# Altium schematic sheet [00] - TK2560_MainBlock.SchDoc
size A3; SheetNumber: 3; SheetTotal: 15
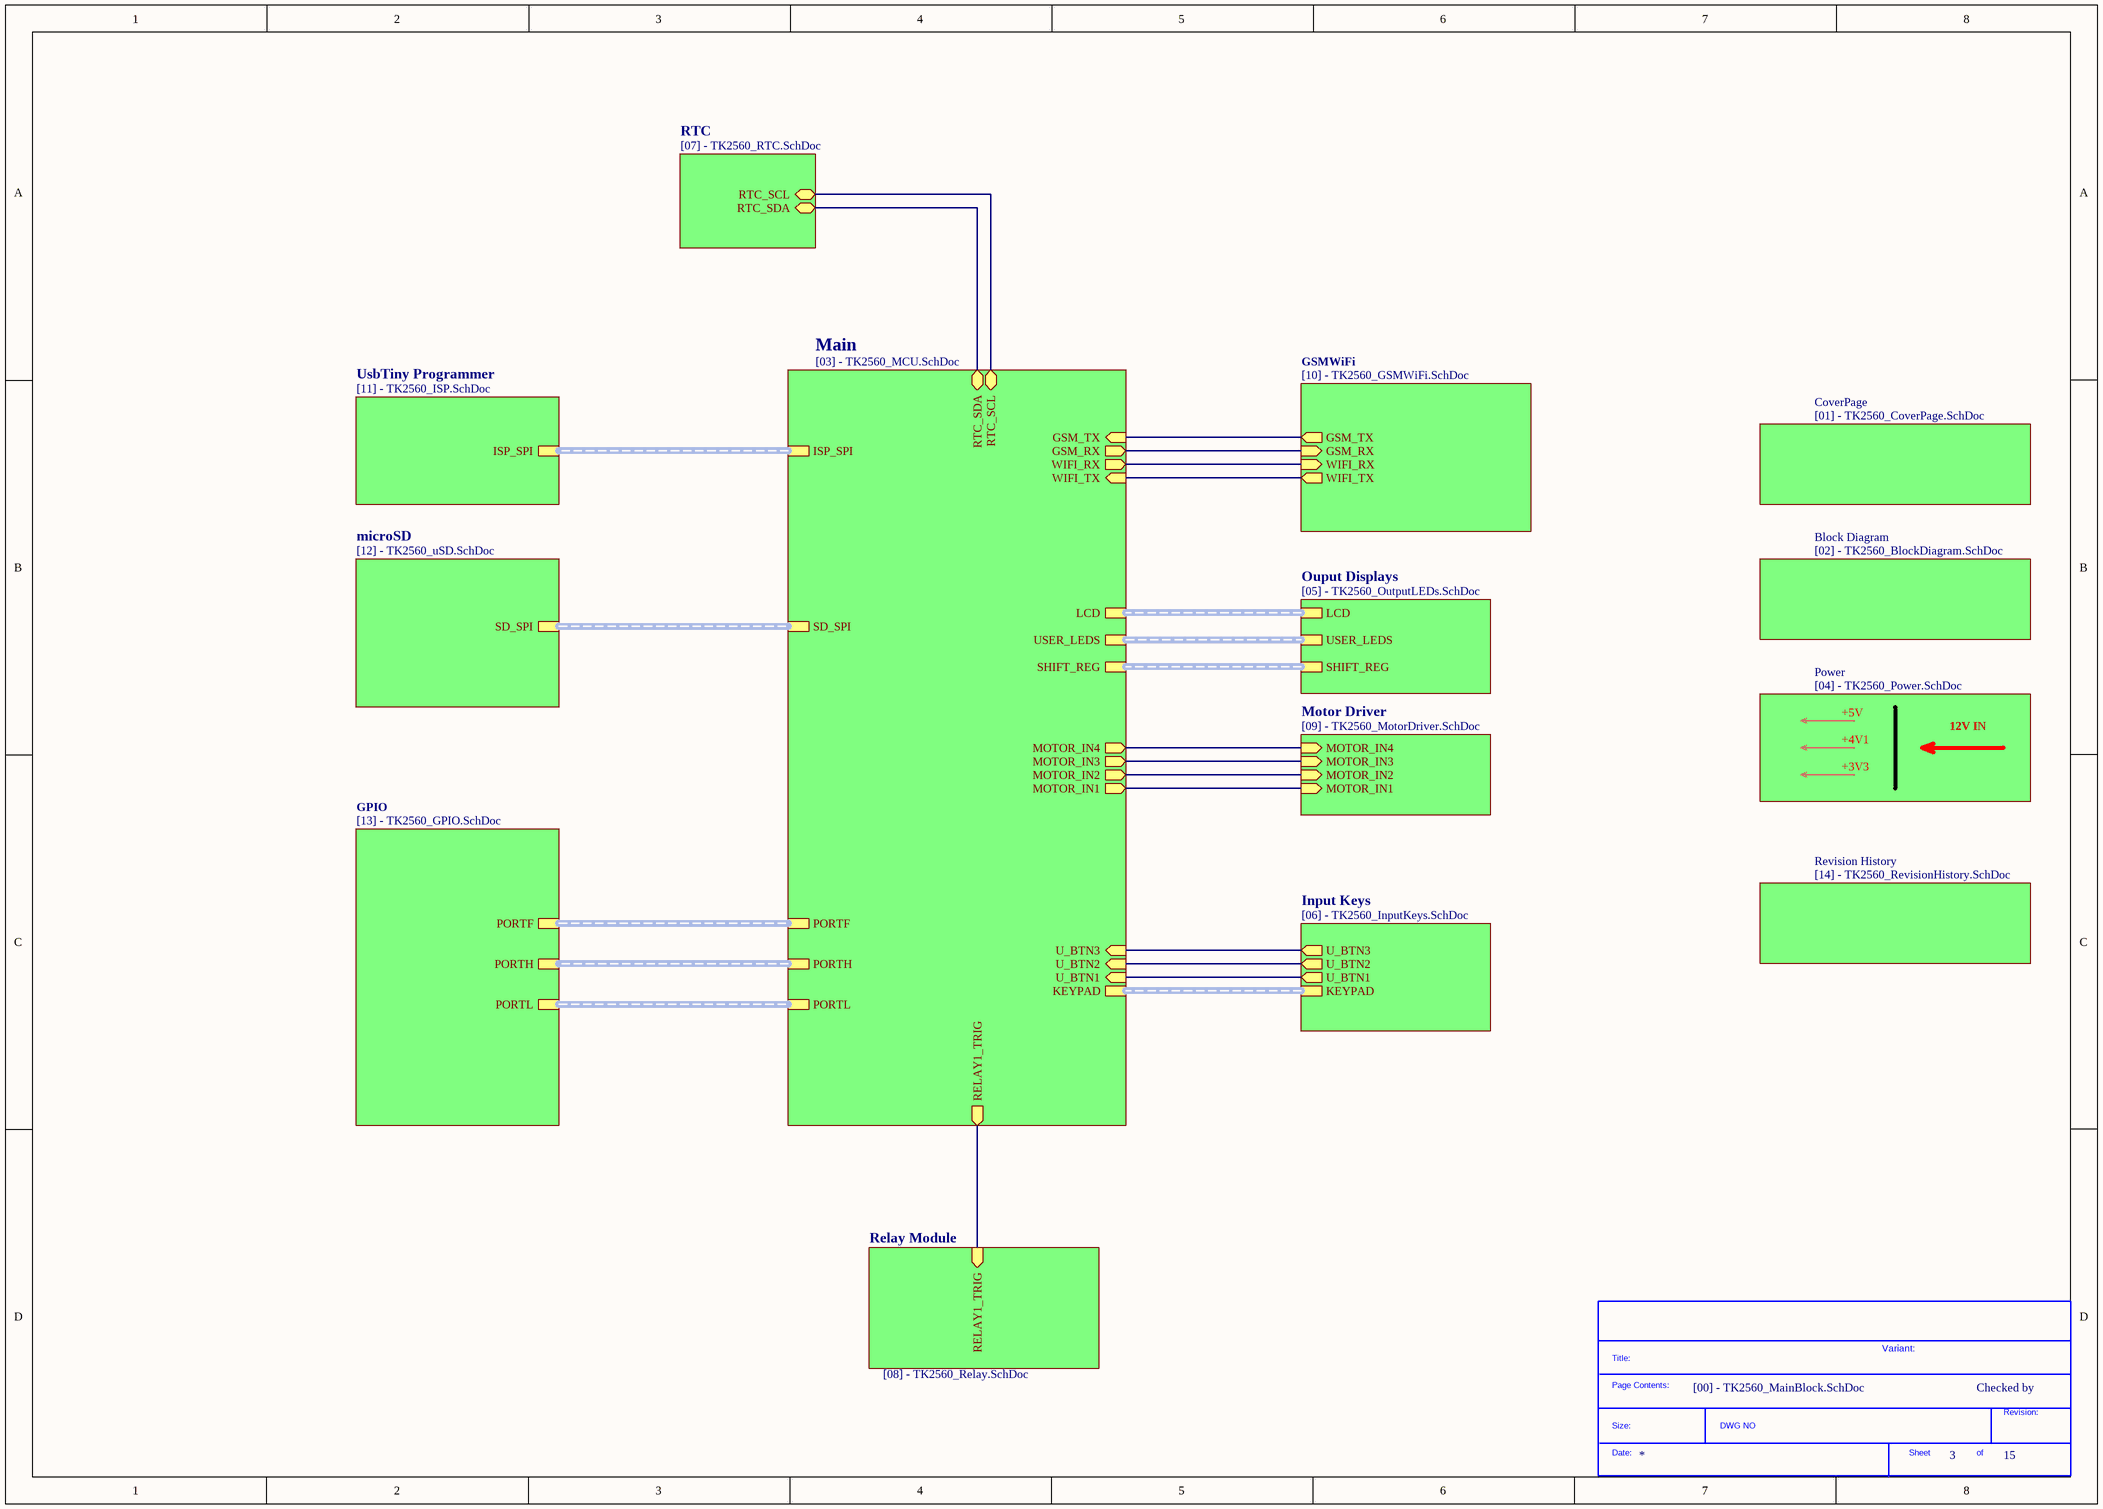
[diagram p0: [00] - TK2560_MainBlock.SchDoc]

## Parts
*?  SDTitleBlock  (value not drawn)  (graphical)

## Sub-sheets
Block Diagram = [02] - TK2560_BlockDiagram.SchDoc: no entries
CoverPage = [01] - TK2560_CoverPage.SchDoc: no entries
GPIO = [13] - TK2560_GPIO.SchDoc: PORTL (harness PORTL), PORTH (harness PORTH), PORTF (harness PORTF)
GSMWiFi = [10] - TK2560_GSMWiFi.SchDoc: GSM_TX (out), GSM_RX (in), WIFI_RX (in), WIFI_TX (out)
Input Keys = [06] - TK2560_InputKeys.SchDoc: U_BTN1 (out), U_BTN2 (out), U_BTN3 (out), KEYPAD (harness KEYPAD)
Main = [03] - TK2560_MCU.SchDoc: SD_SPI (harness SD_SPI), KEYPAD (harness KEYPAD), LCD (harness LCD), RTC_SCL (bidir), ISP_SPI (harness ISP_SPI), RELAY1_TRIG (out), U_BTN1 (in), RTC_SDA (bidir), U_BTN2 (in), USER_LEDS (harness USER_LEDS), U_BTN3 (in), PORTF (harness PORTF), SHIFT_REG (harness SHIFT_REG), GSM_RX (out), GSM_TX (in), WIFI_TX (in), WIFI_RX (out), MOTOR_IN4 (out), MOTOR_IN1 (out), MOTOR_IN3 (out), MOTOR_IN2 (out), PORTL (harness PORTL), PORTH (harness PORTH)
microSD = [12] - TK2560_uSD.SchDoc: SD_SPI (harness SD_SPI)
Motor Driver = [09] - TK2560_MotorDriver.SchDoc: MOTOR_IN1 (in), MOTOR_IN4 (in), MOTOR_IN2 (in), MOTOR_IN3 (in)
Ouput Displays = [05] - TK2560_OutputLEDs.SchDoc: USER_LEDS (harness USER_LEDS), LCD (harness LCD), SHIFT_REG (harness SHIFT_REG)
Power = [04] - TK2560_Power.SchDoc: no entries
Relay Module = [08] - TK2560_Relay.SchDoc: RELAY1_TRIG (in)
Revision History = [14] - TK2560_RevisionHistory.SchDoc: no entries
RTC = [07] - TK2560_RTC.SchDoc: RTC_SCL (bidir), RTC_SDA (bidir)
UsbTiny Programmer = [11] - TK2560_ISP.SchDoc: ISP_SPI (harness ISP_SPI)

## Nets
(unnamed): sheet Main/RTC_SCL, sheet RTC/RTC_SCL
(unnamed): sheet Main/RELAY1_TRIG, sheet Relay Module/RELAY1_TRIG
(unnamed): sheet Main/U_BTN1, sheet Input Keys/U_BTN1
(unnamed): sheet Main/RTC_SDA, sheet RTC/RTC_SDA
(unnamed): sheet Main/U_BTN2, sheet Input Keys/U_BTN2
(unnamed): sheet Main/U_BTN3, sheet Input Keys/U_BTN3
(unnamed): sheet Main/GSM_RX, sheet GSMWiFi/GSM_RX
(unnamed): sheet Main/GSM_TX, sheet GSMWiFi/GSM_TX
(unnamed): sheet Main/WIFI_TX, sheet GSMWiFi/WIFI_TX
(unnamed): sheet Main/WIFI_RX, sheet GSMWiFi/WIFI_RX
(unnamed): sheet Main/MOTOR_IN4, sheet Motor Driver/MOTOR_IN4
(unnamed): sheet Main/MOTOR_IN1, sheet Motor Driver/MOTOR_IN1
(unnamed): sheet Main/MOTOR_IN3, sheet Motor Driver/MOTOR_IN3
(unnamed): sheet Main/MOTOR_IN2, sheet Motor Driver/MOTOR_IN2

## Buses and harness runs
harness sheet GPIO/PORTF = sheet Main/PORTF
harness sheet GPIO/PORTH = sheet Main/PORTH
harness sheet GPIO/PORTL = sheet Main/PORTL
harness sheet Input Keys/KEYPAD = sheet Main/KEYPAD
harness sheet Main/ISP_SPI = sheet UsbTiny Programmer/ISP_SPI
harness sheet Main/LCD = sheet Ouput Displays/LCD
harness sheet Main/SD_SPI = sheet microSD/SD_SPI
harness sheet Main/SHIFT_REG = sheet Ouput Displays/SHIFT_REG
harness sheet Main/USER_LEDS = sheet Ouput Displays/USER_LEDS

## Notes on the sheet
- +5V
- +4V1
- +3V3
- 12V IN
- Variant:
- Checked by
- (in symbol SDTitleBlock) Title:; Page Contents:; Revision:; Size:; DWG NO; Date:; Sheet; of